# Altium schematic sheet Housekeeping.SchDoc: Housekeeping
size A3; PageSetup: Record=PageOptions|CenterHorizontal=True|CenterVertical=True|PrintScale=1.00|XCorrection=1.00|YCorrection=1.00|PrintKind=1|BorderSize=5000000|LeftOffset=0|BottomOffset=0|Orientation=2|PaperLength=1000|PaperWidth=1000|Scale=100|PaperSource=15|PrintQuality=1200|MediaType=1|DitherType=10|PrintScaleMode=1|PaperKind=A4|PaperIndex=9; Organization: Altium Limited; Address1: L3, 12a Rodborough Rd; Address2: Frenchs Forest; Address3: NSW; Address4: Australia 2086; DocumentNumber: 1; Revision: 1.0; SheetNumber: 1; SheetTotal: 8; SheetSize: A3
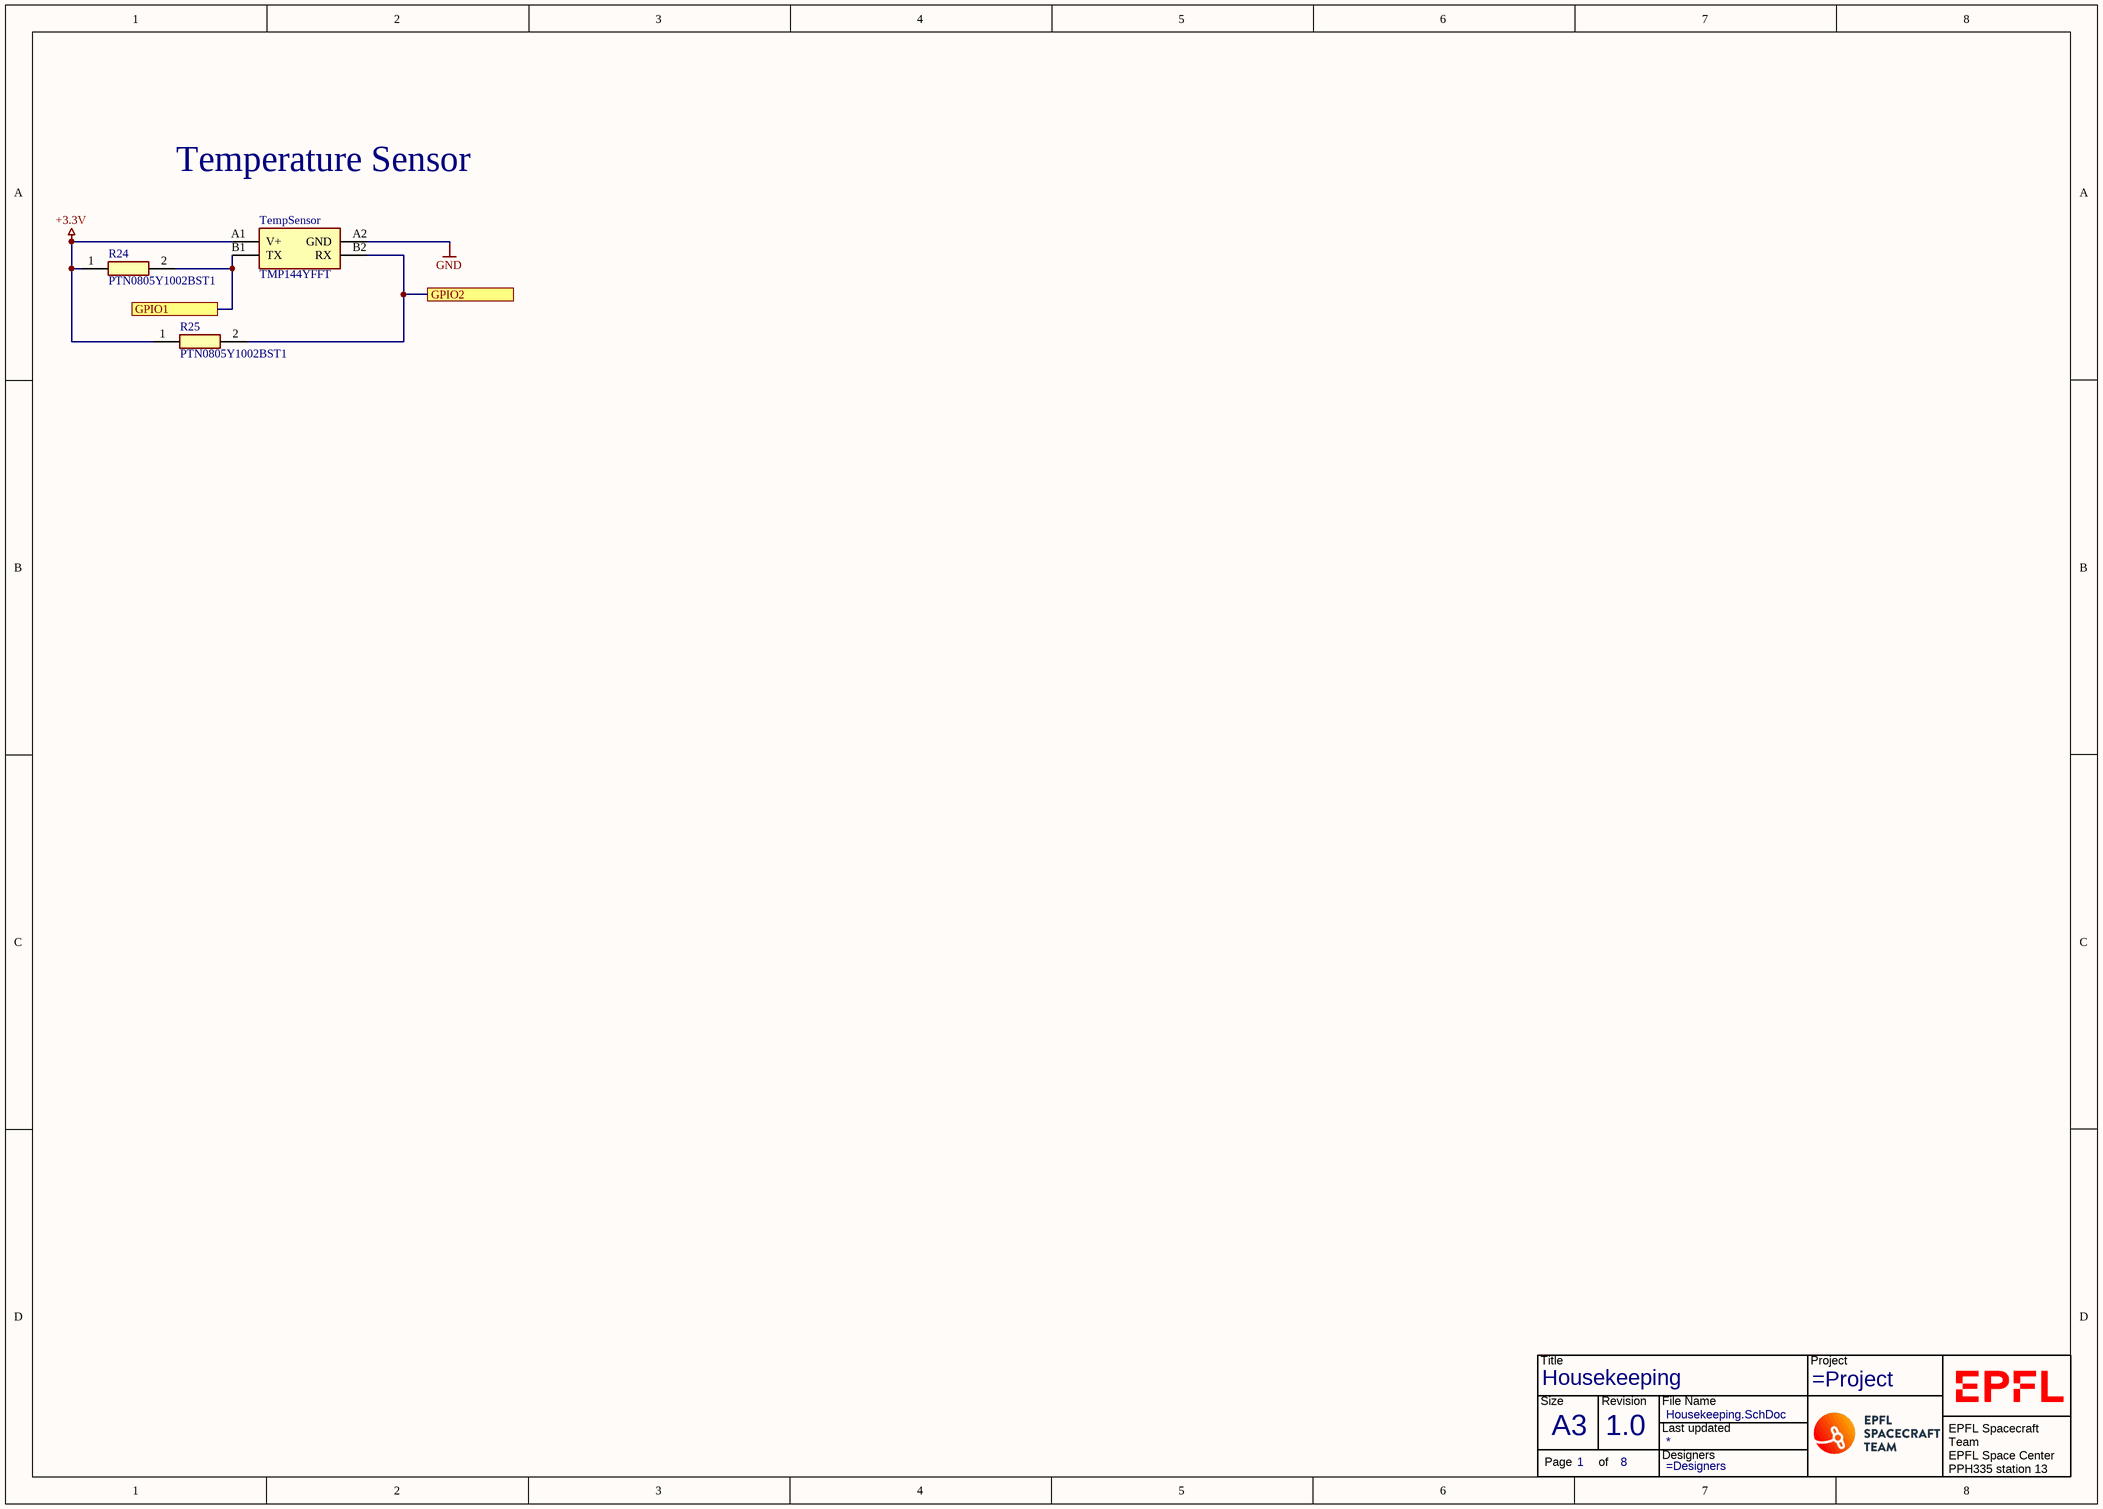
[diagram p0: Housekeeping.SchDoc]

## Parts
*  TitleBlock  (value not drawn)  (graphical)
R24  PTN0805Y1002BST1  [RESC2013X84N]
R25  PTN0805Y1002BST1  [RESC2013X84N]
TempSensor  TMP144YFFT  [TMP144YFFT]

## Ports
GPIO1, GPIO2

## Nets
+3.3V: R24.1 R25.1 TempSensor.A1(V+)
GND: TempSensor.A2(GND)
GPIO1: R24.2 TempSensor.B1(TX) ; port GPIO1
GPIO2: R25.2 TempSensor.B2(RX) ; port GPIO2

## Notes on the sheet
- Temperature Sensor
- Title
- Size:
- Date:
- A3
- Number:
- Time:
- Revision:
- Sheet
- of
- File:
- (in symbol TitleBlock) Title; Project; Size; Revision; File Name; Last updated; Designers; Page; of; EPFL Spacecraft Team / EPFL Space Center / PPH335 station 13 / CH-1015 Lausanne

## Library data of the parts
* = TitleBlock: Title Block with generall information
R24 R25 = PTN0805Y1002BST1: Resistor; Manufacturer_Name: Vishay; Datasheet Link: https://www.mouser.co.uk/datasheet/2/427/ptn-1763593.pdf; Height: 0.838mm; Manufacturer_Part_Number: PTN0805Y1002BST1
TempSensor = TMP144YFFT: Integrated Circuit; Manufacturer_Name: Texas Instruments; Datasheet Link: http://www.ti.com/lit/ds/symlink/tmp144.pdf; Height: 0.625mm; Manufacturer_Part_Number: TMP144YFFT